# Altium project RF-Test-Board.PrjPcb (part 1 of 2)
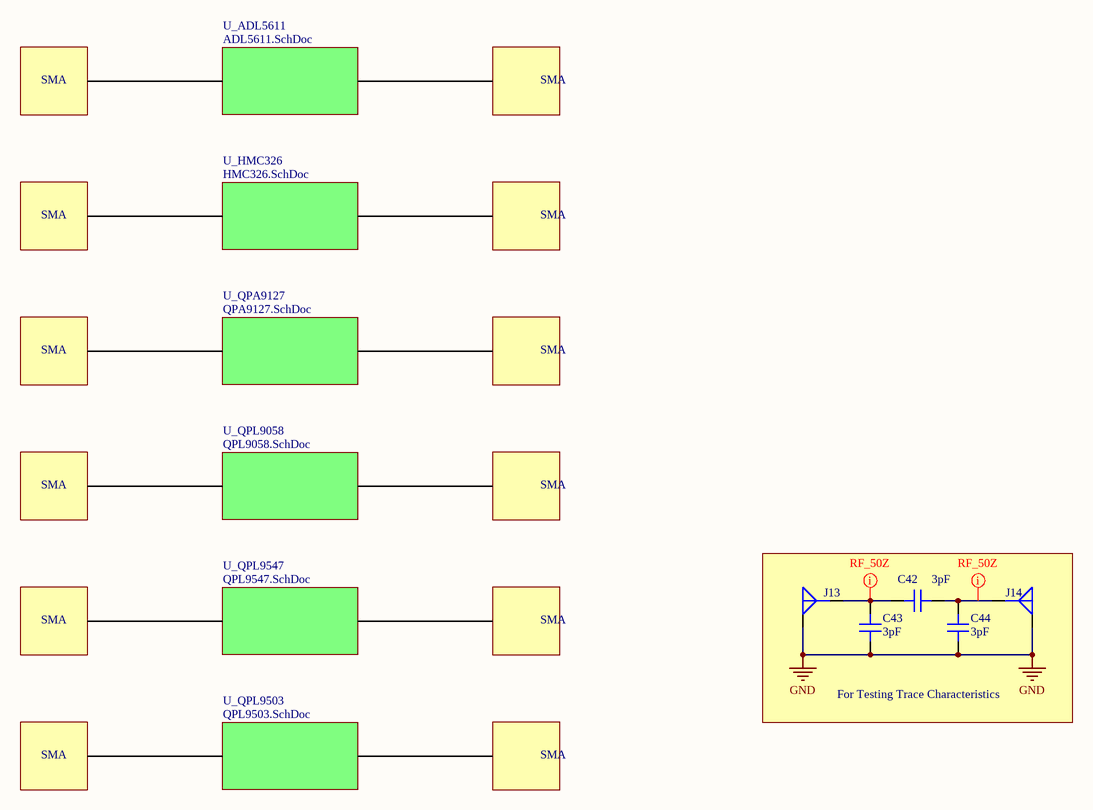
[diagram p0: RF-Test-Board-Sch.SchDoc]
7 sheets, 98 parts. Net scope: global (net labels, ports and power ports of the same name join across sheets).
Board file: RF-Test-Board-Pcb.PcbDoc
Sheets:
  RF-Test-Board-Sch.SchDoc
    U_ADL5611 = ADL5611.SchDoc
    U_HMC326 = HMC326.SchDoc
    U_QPA9127 = QPA9127.SchDoc
    U_QPL9058 = QPL9058.SchDoc
    U_QPL9547 = QPL9547.SchDoc
    U_QPL9503 = QPL9503.SchDoc

## Sheet RF-Test-Board-Sch.SchDoc
size A4; Organization: Altium Limited; Address1: L3, 12a Rodborough Rd; Address2: Frenchs Forest; Address3: NSW; Address4: Australia 2086; DocumentNumber: 1; SheetNumber: 1; SheetTotal: 7

### Parts
C42  3pF  [CAP 0402_1005 RF]
C43  3pF  [CAP 0402_1005 RF]
C44  3pF  [CAP 0402_1005 RF]
J13  CON-SMA-EDGE-S  [CON-SMA-EDGE-S]  (value not drawn)
J14  CON-SMA-EDGE-S  [CON-SMA-EDGE-S]  (value not drawn)

### Blocks framed on the sheet
For Testing Trace Characteristics: C42-C44 J13 J14

### Sub-sheets
U_ADL5611 = ADL5611.SchDoc: no entries
U_HMC326 = HMC326.SchDoc: no entries
U_QPA9127 = QPA9127.SchDoc: no entries
U_QPL9058 = QPL9058.SchDoc: no entries
U_QPL9503 = QPL9503.SchDoc: no entries
U_QPL9547 = QPL9547.SchDoc: no entries

### Nets
GND: C43.1 C44.1 J13.2(G) J14.2(G)
NetC42_1: C42.1 C44.2 J14.1(S)
NetC42_2: C42.2 C43.2 J13.1(S)

### Layout directives
net class RF_50Z: NetC42_1, NetC42_2

### Notes on the sheet
- SMA
- Title
- Author:
- Murat Kucukyilmaz
- Number:
- Date:
- Sheet
- of

### Library data of the parts
C42-C44 = GJM1555C1H3R0CB01J: CAP CER 3PF 50V C0G/NP0 0402; Manufacturer: Murata Electronics; Temperature Coefficient: C0G, NP0; Tolerance: ±0.25pF; Part Number: GJM1555C1H3R0CB01J; Applications: RF, Microwave, High Frequency; Capacitance: 3pF; ComponentLink1Description: Datasheet; ComponentLink1URL: https://search.murata.co.jp/Ceramy/image/img/A01X/G101/ENG/GJM1555C1H3R0CB01-01.pdf; ComponentLink2Description: DigiKey Link; ComponentLink2URL: http://digikey.com/product-detail/en/murata-electronics/GJM1555C1H3R0CB01J/490-8096-1-ND/4380382; Device Package: 0402 (1005 Metric); Features: High Q, Low Loss; LastUpdated: 2.09.2020 01:17:08; Lifecycle Status: Active; Minimum Order: 1; Mounting Type: Surface Mount, MLCC; Operating Temperature: -55°C ~ 125°C; Package / Case: 0402 (1005 Metric); Packaging: TapeAndReel; PartId: 492; Part Status: Active; Price: 0.01; Series: GJM; Size / Dimension: 0.039" L x 0.020" W (1.00mm x 0.50mm); Supplier 1: DigiKey; Supplier Part Number 1: 490-8096-1-ND; Thickness (Max): 0.022" (0.55mm); Value: 3pF; Voltage - Rated: 50V
J13 J14 = CON-SMA-EDGE-S: CONN SMA JACK STR EDGE MNT; Part Number: CON-SMA-EDGE-S; Supplier 1: Digi-Key; Supplier 2: Mouser; Supplier Part Number 1: CON-SMA-EDGE-S-ND; Supplier Part Number 2: 223-CON-SMA-EDGE-S

## Sheet ADL5611.SchDoc
size A4; Organization: Altium Limited; Address1: L3, 12a Rodborough Rd; Address2: Frenchs Forest; Address3: NSW; Address4: Australia 2086; DocumentNumber: 3; SheetNumber: 3; SheetTotal: 7
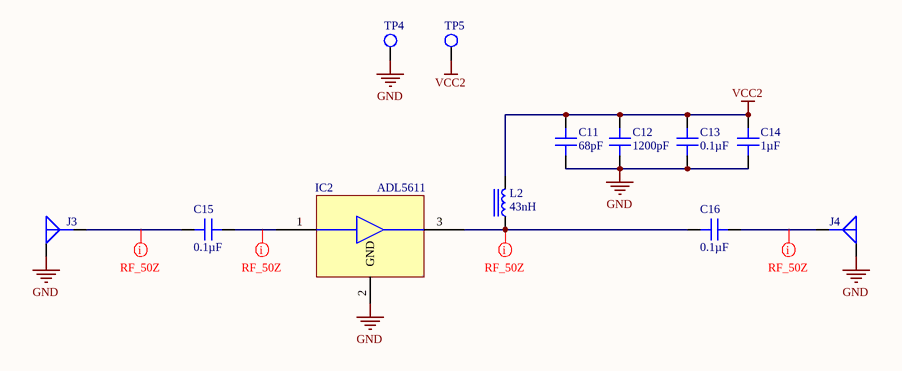
[diagram p1: ADL5611.SchDoc]

### Parts
C11  68pF  [CAP 0402_1005]
C12  1200pF  [CAP 0402_1005]
C13  0.1µF  [CAP 0402_1005]
C14  1µF  [CAP 0402_1005]
C15  0.1µF  [CAP 0402_1005]
C16  0.1µF  [CAP 0402_1005]
IC2  ADL5611  [Analog SOT-89]
J3  CON-SMA-EDGE-S  [CON-SMA-EDGE-S]  (value not drawn)
J4  CON-SMA-EDGE-S  [CON-SMA-EDGE-S]  (value not drawn)
L2  43nH  [0603HP]
TP4  Test Point-THM  [KEYSTONE-THM-TestPoint]  (value not drawn)
TP5  Test Point-THM  [KEYSTONE-THM-TestPoint]  (value not drawn)

### Nets
GND: C11.1 C12.1 C13.1 C14.1 IC2.2(GND) J3.2(G) J4.2(G) TP4.1(TP)
VCC2: C11.2 C12.2 C13.2 C14.2 L2.2 TP5.1(TP)
NetC15_1: C15.1 IC2.1(IN)
NetC15_2: C15.2 J3.1(S)
NetC16_1: C16.1 J4.1(S)
NetC16_2: C16.2 IC2.3(OUT) L2.1

### Layout directives
net class RF_50Z: NetC15_1, NetC15_2, NetC16_1, NetC16_2

### Notes on the sheet
- Title
- Author:
- Murat Kucukyilmaz
- Number:
- Date:
- Sheet
- of

### Library data of the parts
C11 = GCM1555C1H680JA16D: CAP CER 68PF 50V C0G/NP0 0402; Manufacturer: Murata Electronics; Temperature Coefficient: C0G, NP0; Tolerance: ±5%; Part Number: GCM1555C1H680JA16D; Value: 68pF; Applications: Automotive; Capacitance: 68pF; ComponentLink1Description: Datasheet; ComponentLink1URL: https://www.murata.com/~/media/webrenewal/support/library/catalog/products/capacitor/mlcc/c03e.ashx?la=en-us; ComponentLink2Description: DigiKey Link; ComponentLink2URL: http://digikey.com/product-detail/en/murata-electronics/GCM1555C1H680JA16D/490-12653-1-ND/5797622; Device Package: 0402 (1005 Metric); LastUpdated: 2.09.2020 01:02:15; Lifecycle Status: Active; Minimum Order: 1; Mounting Type: Surface Mount, MLCC; Operating Temperature: -55°C ~ 125°C; Package / Case: 0402 (1005 Metric); Packaging: TapeAndReel; PartId: 5827; Part Status: Active; Price: 0.01; Ratings: AEC-Q200; Series: GCM; Size / Dimension: 0.039" L x 0.020" W (1.00mm x 0.50mm); Supplier 1: DigiKey; Supplier Part Number 1: 490-12653-1-ND; Thickness (Max): 0.022" (0.55mm); Voltage - Rated: 50V
C12 = GCM155R71H122JA37D: CAP CER 1200PF 50V X7R 0402; Manufacturer: Murata Electronics; Tolerance: ±5%; Part Number: GCM155R71H122JA37D; Value: 1200pF; Applications: Automotive; Capacitance: 1200pF; ComponentLink1Description: Datasheet; ComponentLink1URL: https://search.murata.co.jp/Ceramy/image/img/A01X/G101/ENG/GCM155R71H122JA37-01.pdf; ComponentLink2Description: DigiKey Link; ComponentLink2URL: http://digikey.com/product-detail/en/murata-electronics/GCM155R71H122JA37D/490-17759-1-ND/8539995; Device Package: 0402 (1005 Metric); LastUpdated: 2.09.2020 01:02:22; Lifecycle Status: Active; Minimum Order: 1; Mounting Type: Surface Mount, MLCC; Operating Temperature: -55°C ~ 125°C; Package / Case: 0402 (1005 Metric); Packaging: TapeAndReel; PartId: 2713; Part Status: Active; Price: 0.01; Ratings: AEC-Q200; Series: GCM; Size / Dimension: 0.039" L x 0.020" W (1.00mm x 0.50mm); Supplier 1: DigiKey; Supplier Part Number 1: 490-17759-1-ND; Temperature Coefficient: X7R; Thickness (Max): 0.022" (0.55mm); Voltage - Rated: 50V
C13 C15 C16 = EMK105B7104KV-F: CAP CER 0.1UF 16V X7R 0402; Manufacturer: Taiyo Yuden; Tolerance: ±10%; Part Number: EMK105B7104KV-F; Value: 0.1µF; Applications: General Purpose; Capacitance: 0.1µF; ComponentLink1Description: Datasheet; ComponentLink1URL: https://ds.yuden.co.jp/TYCOMPAS/ut/detail?pn=EMK105B7104KV-F  &u=M; ComponentLink2Description: DigiKey Link; ComponentLink2URL: http://digikey.com/product-detail/en/taiyo-yuden/EMK105B7104KV-F/587-1451-1-ND/1004082; Device Package: 0402 (1005 Metric); LastUpdated: 2.09.2020 01:02:15; Lifecycle Status: Active; Minimum Order: 1; Mounting Type: Surface Mount, MLCC; Operating Temperature: -55°C ~ 125°C; Package / Case: 0402 (1005 Metric); Packaging: CutTape; PartId: 6070; Part Status: Active; Price: 0.10; Series: M; Size / Dimension: 0.039" L x 0.020" W (1.00mm x 0.50mm); Supplier 1: DigiKey; Supplier Part Number 1: 587-1451-1-ND; Temperature Coefficient: X7R; Thickness (Max): 0.022" (0.55mm); Voltage - Rated: 16V
C14 = CL05A105KP5NNNC: CAP CER 1UF 10V X5R 0402; Manufacturer: Samsung Electro-Mechanics; Tolerance: ±10%; Part Number: CL05A105KP5NNNC; Value: 1µF; Applications: General Purpose; Capacitance: 1µF; ComponentLink1Description: Datasheet; ComponentLink1URL: http://www.samsungsem.com/kr/support/product-search/mlcc/CL05A105KP5NNNC.jsp; ComponentLink2Description: DigiKey Link; ComponentLink2URL: http://digikey.com/product-detail/en/samsung-electro-mechanics/CL05A105KP5NNNC/1276-1076-1-ND/3889162; Device Package: 0402 (1005 Metric); LastUpdated: 2.09.2020 01:02:21; Lifecycle Status: Active; Minimum Order: 1; Mounting Type: Surface Mount, MLCC; Operating Temperature: -55°C ~ 85°C; Package / Case: 0402 (1005 Metric); Packaging: TapeAndReel; PartId: 3103; Part Status: Active; Price: 0.01; Series: CL; Size / Dimension: 0.039" L x 0.020" W (1.00mm x 0.50mm); Supplier 1: DigiKey; Supplier Part Number 1: 1276-1076-1-ND; Temperature Coefficient: X5R; Thickness (Max): 0.022" (0.55mm); Voltage - Rated: 10V
IC2 = ADL5611: IC AMP W-CDMA 30MHZ-6GHZ SOT89-3; Part Number: ADL5611; Supplier 1: Digi-Key; Supplier 2: Mouser; Supplier Part Number 1: ADL5611ARKZ-R7CT-ND; Supplier Part Number 2: 584-ADL5611ARKZ-R7
J3 J4 = CON-SMA-EDGE-S: CONN SMA JACK STR EDGE MNT; Part Number: CON-SMA-EDGE-S; Supplier 1: Digi-Key; Supplier 2: Mouser; Supplier Part Number 1: CON-SMA-EDGE-S-ND; Supplier Part Number 2: 223-CON-SMA-EDGE-S
L2 = 0603HP-43NXGLW: Fixed Inductors 0603 43nH Unshld 2% 810mA 170mOhms; Value: 43nH; Supplier 1: Mouser; Supplier Part Number 1: 994-0603HP-43NXGLW
TP4 TP5 = Test Point-THM: THRU HOLE MOUNT TEST POINTS; Supplier 1: Digi-Key; Supplier 2: Mouser; Supplier Part Number 1: 36-5012-ND; Supplier Part Number 2: 534-5012

## Sheet HMC326.SchDoc
size A4; Organization: Altium Limited; Address1: L3, 12a Rodborough Rd; Address2: Frenchs Forest; Address3: NSW; Address4: Australia 2086; DocumentNumber: 2; SheetNumber: 2; SheetTotal: 7
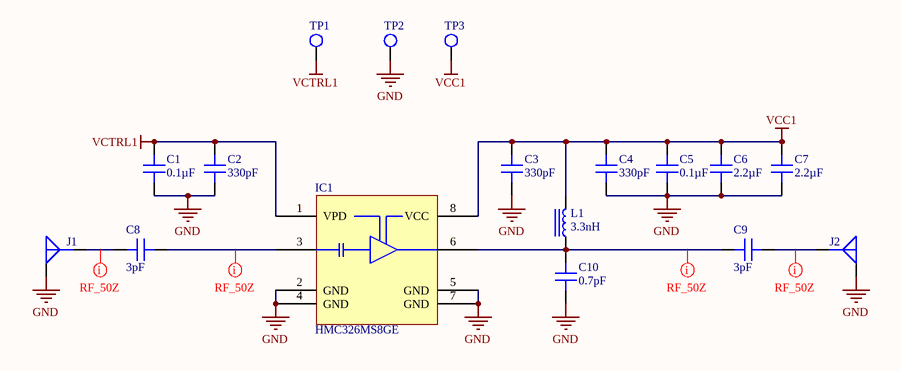
[diagram p2: HMC326.SchDoc]

### Parts
C1  0.1µF  [CAP 0402_1005]
C2  330pF  [CAP 0402_1005]
C3  330pF  [CAP 0402_1005]
C4  330pF  [CAP 0402_1005]
C5  0.1µF  [CAP 0402_1005]
C6  2.2µF  [CAP 0402_1005]
C7  2.2µF  [CAP 0402_1005]
C8  3pF  [CAP 0402_1005 RF]
C9  3pF  [CAP 0402_1005 RF]
C10  0.7pF  [CAP 0402_1005 RF]
IC1  HMC326MS8GE  [ANALOG MSOP8G 3x3MM]
J1  CON-SMA-EDGE-S  [CON-SMA-EDGE-S]  (value not drawn)
J2  CON-SMA-EDGE-S  [CON-SMA-EDGE-S]  (value not drawn)
L1  3.3nH  [0603HP]
TP1  Test Point-THM  [KEYSTONE-THM-TestPoint]  (value not drawn)
TP2  Test Point-THM  [KEYSTONE-THM-TestPoint]  (value not drawn)
TP3  Test Point-THM  [KEYSTONE-THM-TestPoint]  (value not drawn)

### Nets
GND: C1.1 C2.1 C3.1 C4.1 C5.1 C6.1 C7.1 C10.1 IC1.2(GND) IC1.4(GND) IC1.5(GND) IC1.7(GND) J1.2(G) J2.2(G) TP2.1(TP)
VCC1: C3.2 C4.2 C5.2 C6.2 C7.2 IC1.8(VCC) L1.2 TP3.1(TP)
VCTRL1: C1.2 C2.2 IC1.1(VPD) TP1.1(TP)
NetC8_1: C8.1 IC1.3(IN)
NetC8_2: C8.2 J1.1(S)
NetC9_1: C9.1 C10.2 IC1.6(OUT) L1.1
NetC9_2: C9.2 J2.1(S)

### Layout directives
net class RF_50Z: NetC8_1, NetC8_2, NetC9_1, NetC9_2

### Notes on the sheet
- Title
- Author:
- Murat Kucukyilmaz
- Number:
- Date:
- Sheet
- of

### Library data of the parts
C1 C5 = EMK105B7104KV-F: as C13 on sheet ADL5611; Part Number: EMK105B7104KV-F; Value: 0.1µF; Applications: General Purpose; Capacitance: 0.1µF; ComponentLink1Description: Datasheet; ComponentLink1URL: https://ds.yuden.co.jp/TYCOMPAS/ut/detail?pn=EMK105B7104KV-F  &u=M; ComponentLink2Description: DigiKey Link; ComponentLink2URL: http://digikey.com/product-detail/en/taiyo-yuden/EMK105B7104KV-F/587-1451-1-ND/1004082; Device Package: 0402 (1005 Metric); LastUpdated: 2.09.2020 01:02:15; Lifecycle Status: Active; Minimum Order: 1; Mounting Type: Surface Mount, MLCC; Operating Temperature: -55°C ~ 125°C; Package / Case: 0402 (1005 Metric); Packaging: CutTape; PartId: 6070; Part Status: Active; Price: 0.10; Series: M; Size / Dimension: 0.039" L x 0.020" W (1.00mm x 0.50mm); Supplier 1: DigiKey; Supplier Part Number 1: 587-1451-1-ND; Temperature Coefficient: X7R; Thickness (Max): 0.022" (0.55mm); Voltage - Rated: 16V
C2-C4 = CL05B331KB5NNNC: CAP CER 330PF 50V X7R 0402; Manufacturer: Samsung Electro-Mechanics; Tolerance: ±10%; Part Number: CL05B331KB5NNNC; Value: 330pF; Applications: General Purpose; Capacitance: 330pF; ComponentLink1Description: Datasheet; ComponentLink1URL: http://www.samsungsem.com/kr/support/product-search/mlcc/CL05B331KB5NNNC.jsp; ComponentLink2Description: DigiKey Link; ComponentLink2URL: http://digikey.com/product-detail/en/samsung-electro-mechanics/CL05B331KB5NNNC/1276-1546-1-ND/3889632; Device Package: 0402 (1005 Metric); LastUpdated: 2.09.2020 01:02:05; Lifecycle Status: Active; Minimum Order: 1; Mounting Type: Surface Mount, MLCC; Operating Temperature: -55°C ~ 125°C; Package / Case: 0402 (1005 Metric); Packaging: TapeAndReel; PartId: 10570; Part Status: Active; Price: 0.01; Series: CL; Size / Dimension: 0.039" L x 0.020" W (1.00mm x 0.50mm); Supplier 1: DigiKey; Supplier Part Number 1: 1276-1546-1-ND; Temperature Coefficient: X7R; Thickness (Max): 0.022" (0.55mm); Voltage - Rated: 50V
C6 C7 = LMK105BJ225MV-F: CAP CER 2.2UF 10V X5R 0402; Manufacturer: Taiyo Yuden; Tolerance: ±20%; Part Number: LMK105BJ225MV-F; Value: 2.2µF; Applications: General Purpose; Capacitance: 2.2µF; ComponentLink1Description: Datasheet; ComponentLink1URL: https://www.yuden.co.jp/productdata/catalog/mlcc01_e.pdf; ComponentLink2Description: DigiKey Link; ComponentLink2URL: http://digikey.com/product-detail/en/taiyo-yuden/LMK105BJ225MV-F/587-3153-1-ND/2774767; Device Package: 0402 (1005 Metric); LastUpdated: 2.09.2020 01:02:21; Lifecycle Status: Active; Minimum Order: 1; Mounting Type: Surface Mount, MLCC; Operating Temperature: -55°C ~ 85°C; Package / Case: 0402 (1005 Metric); Packaging: TapeAndReel; PartId: 3142; Part Status: Active; Price: 0.01; Series: M; Size / Dimension: 0.039" L x 0.020" W (1.00mm x 0.50mm); Supplier 1: DigiKey; Supplier Part Number 1: 587-3153-1-ND; Temperature Coefficient: X5R; Thickness (Max): 0.022" (0.55mm); Voltage - Rated: 10V
C8 C9 = GJM1555C1H3R0CB01J: as C42 on sheet RF-Test-Board-Sch; Part Number: GJM1555C1H3R0CB01J; Applications: RF, Microwave, High Frequency; Capacitance: 3pF; ComponentLink1Description: Datasheet; ComponentLink1URL: https://search.murata.co.jp/Ceramy/image/img/A01X/G101/ENG/GJM1555C1H3R0CB01-01.pdf; ComponentLink2Description: DigiKey Link; ComponentLink2URL: http://digikey.com/product-detail/en/murata-electronics/GJM1555C1H3R0CB01J/490-8096-1-ND/4380382; Device Package: 0402 (1005 Metric); Features: High Q, Low Loss; LastUpdated: 2.09.2020 01:17:08; Lifecycle Status: Active; Minimum Order: 1; Mounting Type: Surface Mount, MLCC; Operating Temperature: -55°C ~ 125°C; Package / Case: 0402 (1005 Metric); Packaging: TapeAndReel; PartId: 492; Part Status: Active; Price: 0.01; Series: GJM; Size / Dimension: 0.039" L x 0.020" W (1.00mm x 0.50mm); Supplier 1: DigiKey; Supplier Part Number 1: 490-8096-1-ND; Thickness (Max): 0.022" (0.55mm); Value: 3pF; Voltage - Rated: 50V
C10 = GJM1555C1HR70BB01D: CAP CER 0.7PF 50V C0G/NP0 0402; Manufacturer: Murata Electronics; Temperature Coefficient: C0G, NP0; Tolerance: ±0.1pF; Part Number: GJM1555C1HR70BB01D; Applications: RF, Microwave, High Frequency; Capacitance: 0.7pF; ComponentLink1Description: Datasheet; ComponentLink1URL: https://search.murata.co.jp/Ceramy/image/img/A01X/G101/ENG/GJM1555C1HR70BB01-01.pdf; ComponentLink2Description: DigiKey Link; ComponentLink2URL: http://digikey.com/product-detail/en/murata-electronics/GJM1555C1HR70BB01D/490-6079-1-ND/3845279; Device Package: 0402 (1005 Metric); Features: High Q, Low Loss; LastUpdated: 2.09.2020 01:17:05; Lifecycle Status: Active; Minimum Order: 1; Mounting Type: Surface Mount, MLCC; Operating Temperature: -55°C ~ 125°C; Package / Case: 0402 (1005 Metric); Packaging: TapeAndReel; PartId: 1691; Part Status: Active; Price: 0.03; Series: GJM; Size / Dimension: 0.039" L x 0.020" W (1.00mm x 0.50mm); Supplier 1: DigiKey; Supplier Part Number 1: 490-6079-1-ND; Thickness (Max): 0.022" (0.55mm); Value: 0.7pF; Voltage - Rated: 50V
IC1 = HMC326MS8GE: IC RF AMP GP 3GHZ-4.5GHZ 8MSOP; Part Number: HMC326MS8GE; Supplier 1: Digi-Key; Supplier Part Number 1: 1127-1333-ND
J1 J2 = CON-SMA-EDGE-S: CONN SMA JACK STR EDGE MNT; Part Number: CON-SMA-EDGE-S; Supplier 1: Digi-Key; Supplier 2: Mouser; Supplier Part Number 1: CON-SMA-EDGE-S-ND; Supplier Part Number 2: 223-CON-SMA-EDGE-S
L1 = 0603HP-3N3XGLW: Fixed Inductors 0603 3.3nH Unshld 2% 1.9A 24mOhms; Value: 3.3nH; Supplier 1: Mouser; Supplier Part Number 1: 994-0603HP-3N3XGLW
TP1-TP3 = Test Point-THM: THRU HOLE MOUNT TEST POINTS; Supplier 1: Digi-Key; Supplier 2: Mouser; Supplier Part Number 1: 36-5012-ND; Supplier Part Number 2: 534-5012

## Sheet QPA9127.SchDoc
size A4; Organization: Altium Limited; Address1: L3, 12a Rodborough Rd; Address2: Frenchs Forest; Address3: NSW; Address4: Australia 2086; DocumentNumber: 4; SheetNumber: 4; SheetTotal: 7
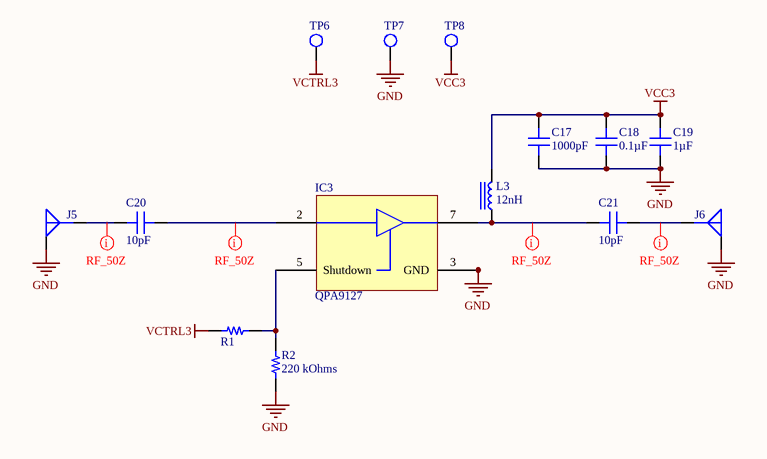
[diagram p3: QPA9127.SchDoc]

### Parts
C17  1000pF  [CAP 0402_1005]
C18  0.1µF  [CAP 0402_1005]
C19  1µF  [CAP 0402_1005]
C20  10pF  [CAP 0402_1005 RF]
C21  10pF  [CAP 0402_1005 RF]
IC3  QPA9127  [Qorvo PA DFN-8 2X2]
J5  CON-SMA-EDGE-S  [CON-SMA-EDGE-S]  (value not drawn)
J6  CON-SMA-EDGE-S  [CON-SMA-EDGE-S]  (value not drawn)
L3  12nH  [0603HP]
R1  (no value)  [RES 0402_1005]
R2  220 kOhms  [RES 0402_1005]
TP6  Test Point-THM  [KEYSTONE-THM-TestPoint]  (value not drawn)
TP7  Test Point-THM  [KEYSTONE-THM-TestPoint]  (value not drawn)
TP8  Test Point-THM  [KEYSTONE-THM-TestPoint]  (value not drawn)

### Nets
GND: C17.1 C18.1 C19.1 IC3.1(GND) IC3.3(GND) IC3.4(GND) IC3.6(GND) IC3.8(GND) IC3.9(GND) J5.2(G) J6.2(G) R2.1 TP7.1(TP)
VCC3: C17.2 C18.2 C19.2 L3.2 TP8.1(TP)
VCTRL3: R1.1 TP6.1(TP)
NetC20_1: C20.1 J5.1(S)
NetC20_2: C20.2 IC3.2(IN)
NetC21_1: C21.1 IC3.7(OUT) L3.1
NetC21_2: C21.2 J6.1(S)
NetIC3_5: IC3.5(Shutdown) R1.2 R2.2

### Layout directives
net class RF_50Z: NetC20_1, NetC20_2, NetC21_1, NetC21_2

### Notes on the sheet
- Title
- Author:
- Murat Kucukyilmaz
- Number:
- Date:
- Sheet
- of

### Library data of the parts
C17 = GCM155R71H102KA37D: CAP CER 1000PF 50V X7R 0402; Manufacturer: Murata Electronics; Tolerance: ±10%; Part Number: GCM155R71H102KA37D; Value: 1000pF; Applications: Automotive; Capacitance: 1000pF; ComponentLink1Description: Datasheet; ComponentLink1URL: https://psearch.en.murata.com/capacitor/product/GCM155R71H102KA37%23.pdf; ComponentLink2Description: DigiKey Link; ComponentLink2URL: http://digikey.com/product-detail/en/murata-electronics/GCM155R71H102KA37D/490-4761-1-ND/1641680; Device Package: 0402 (1005 Metric); LastUpdated: 2.09.2020 01:01:39; Lifecycle Status: Active; Minimum Order: 1; Mounting Type: Surface Mount, MLCC; Operating Temperature: -55°C ~ 125°C; Package / Case: 0402 (1005 Metric); Packaging: TapeAndReel; PartId: 12579; Part Status: Active; Price: 0.01; Ratings: AEC-Q200; Series: GCM; Size / Dimension: 0.039" L x 0.020" W (1.00mm x 0.50mm); Supplier 1: DigiKey; Supplier Part Number 1: 490-4761-1-ND; Temperature Coefficient: X7R; Thickness (Max): 0.022" (0.55mm); Voltage - Rated: 50V
C18 = EMK105B7104KV-F: as C13 on sheet ADL5611; Part Number: EMK105B7104KV-F; Value: 0.1µF; Applications: General Purpose; Capacitance: 0.1µF; ComponentLink1Description: Datasheet; ComponentLink1URL: https://ds.yuden.co.jp/TYCOMPAS/ut/detail?pn=EMK105B7104KV-F  &u=M; ComponentLink2Description: DigiKey Link; ComponentLink2URL: http://digikey.com/product-detail/en/taiyo-yuden/EMK105B7104KV-F/587-1451-1-ND/1004082; Device Package: 0402 (1005 Metric); LastUpdated: 2.09.2020 01:02:15; Lifecycle Status: Active; Minimum Order: 1; Mounting Type: Surface Mount, MLCC; Operating Temperature: -55°C ~ 125°C; Package / Case: 0402 (1005 Metric); Packaging: CutTape; PartId: 6070; Part Status: Active; Price: 0.10; Series: M; Size / Dimension: 0.039" L x 0.020" W (1.00mm x 0.50mm); Supplier 1: DigiKey; Supplier Part Number 1: 587-1451-1-ND; Temperature Coefficient: X7R; Thickness (Max): 0.022" (0.55mm); Voltage - Rated: 16V
C19 = CL05A105KP5NNNC: as C14 on sheet ADL5611; Part Number: CL05A105KP5NNNC; Value: 1µF; Applications: General Purpose; Capacitance: 1µF; ComponentLink1Description: Datasheet; ComponentLink1URL: http://www.samsungsem.com/kr/support/product-search/mlcc/CL05A105KP5NNNC.jsp; ComponentLink2Description: DigiKey Link; ComponentLink2URL: http://digikey.com/product-detail/en/samsung-electro-mechanics/CL05A105KP5NNNC/1276-1076-1-ND/3889162; Device Package: 0402 (1005 Metric); LastUpdated: 2.09.2020 01:02:21; Lifecycle Status: Active; Minimum Order: 1; Mounting Type: Surface Mount, MLCC; Operating Temperature: -55°C ~ 85°C; Package / Case: 0402 (1005 Metric); Packaging: TapeAndReel; PartId: 3103; Part Status: Active; Price: 0.01; Series: CL; Size / Dimension: 0.039" L x 0.020" W (1.00mm x 0.50mm); Supplier 1: DigiKey; Supplier Part Number 1: 1276-1076-1-ND; Temperature Coefficient: X5R; Thickness (Max): 0.022" (0.55mm); Voltage - Rated: 10V
C20 C21 = GJM1555C1H100FB01D: CAP CER 10PF 50V C0G/NP0 0402; Manufacturer: Murata Electronics; Temperature Coefficient: C0G, NP0; Tolerance: ±1%; Part Number: GJM1555C1H100FB01D; Applications: RF, Microwave, High Frequency; Capacitance: 10pF; ComponentLink1Description: Datasheet; ComponentLink1URL: https://search.murata.co.jp/Ceramy/image/img/A01X/G101/ENG/GJM1555C1H100FB01-01.pdf; ComponentLink2Description: DigiKey Link; ComponentLink2URL: http://digikey.com/product-detail/en/murata-electronics/GJM1555C1H100FB01D/490-11189-1-ND/5333029; Device Package: 0402 (1005 Metric); Features: High Q, Low Loss; LastUpdated: 2.09.2020 01:17:07; Lifecycle Status: Active; Minimum Order: 1; Mounting Type: Surface Mount, MLCC; Operating Temperature: -55°C ~ 125°C; Package / Case: 0402 (1005 Metric); Packaging: TapeAndReel; PartId: 560; Part Status: Active; Price: 0.04; Series: GJM; Size / Dimension: 0.039" L x 0.020" W (1.00mm x 0.50mm); Supplier 1: DigiKey; Supplier Part Number 1: 490-11189-1-ND; Thickness (Max): 0.022" (0.55mm); Value: 10pF; Voltage - Rated: 50V
IC3 = QPA9127: High Linearity Gain Block; Part Number: QPA9127; Supplier 1: Mouser; Supplier Part Number 1: 772-QPA9127TR7
J5 J6 = CON-SMA-EDGE-S: CONN SMA JACK STR EDGE MNT; Part Number: CON-SMA-EDGE-S; Supplier 1: Digi-Key; Supplier 2: Mouser; Supplier Part Number 1: CON-SMA-EDGE-S-ND; Supplier Part Number 2: 223-CON-SMA-EDGE-S
L3 = 0603HP-12NXGLW: Fixed Inductors 0603 12nH Unshld 2% 1.1A 88mOhms; Value: 12nH; Supplier 1: Mouser; Supplier Part Number 1: 994-0603HP-12NXGLW
R1 = RC0402JR-070RP: RES SMD 0 OHM JUMPER 1/16W 0402; Manufacturer: Yageo; Power (Watts): 0.063W, 1/16W; Part Number: RC0402JR-070RP; ComponentLink1Description: Datasheet; ComponentLink1URL: http://www.yageo.com/NewPortal/yageodocoutput?fileName=/pdf/R-Chip/PYu-RC_51_RoHS_P_0.pdf; ComponentLink2Description: DigiKey Link; ComponentLink2URL: http://digikey.com/product-detail/en/yageo/RC0402JR-070RP/YAG1279CT-ND/4935394; Composition: Thick Film; Device Package: 0402 (1005 Metric); Features: Moisture Resistant; Height - Seated (Max): 0.016" (0.40mm); LastUpdated: 2.09.2020 01:07:33; Lifecycle Status: Active; Minimum Order: 1; Number of Terminations: 2; Operating Temperature: -55°C ~ 155°C; Package / Case: 0402 (1005 Metric); Packaging: CutTape; PartId: 18920; Part Status: Active; Price: 0.10; Series: RC-P Lead Free; Size / Dimension: 0.039" L x 0.020" W (1.00mm x 0.50mm); Supplier 1: DigiKey; Supplier Part Number 1: YAG1279CT-ND; Supplier Device Package: 0402; Tolerance: Jumper
R2 = RC0402FR-07220KL: RES SMD 220K OHM 1% 1/16W 0402; Manufacturer: Yageo; Power (Watts): 0.063W, 1/16W; Temperature Coefficient: ±100ppm/°C; Part Number: RC0402FR-07220KL; Value: 220 kOhms; ComponentLink1Description: Datasheet; ComponentLink1URL: https://www.yageo.com/upload/media/product/productsearch/datasheet/rchip/PYu-RC_Group_51_RoHS_L_10.pdf; ComponentLink2Description: DigiKey Link; ComponentLink2URL: http://digikey.com/product-detail/en/yageo/RC0402FR-07220KL/311-220KLRCT-ND/729511; Composition: Thick Film; Device Package: 0402 (1005 Metric); Features: Moisture Resistant; Height - Seated (Max): 0.016" (0.40mm); LastUpdated: 2.09.2020 01:08:10; Lifecycle Status: Active; Minimum Order: 1; Number of Terminations: 2; Operating Temperature: -55°C ~ 155°C; Package / Case: 0402 (1005 Metric); Packaging: CutTape; PartId: 2589; Part Status: Active; Price: 0.10; Resistance: 220 kOhms; Series: RC; Size / Dimension: 0.039" L x 0.020" W (1.00mm x 0.50mm); Supplier 1: DigiKey; Supplier Part Number 1: 311-220KLRCT-ND; Supplier Device Package: 0402; Tolerance: ±1%
TP6-TP8 = Test Point-THM: THRU HOLE MOUNT TEST POINTS; Supplier 1: Digi-Key; Supplier 2: Mouser; Supplier Part Number 1: 36-5012-ND; Supplier Part Number 2: 534-5012

## Sheet QPL9058.SchDoc
size A4; Organization: Altium Limited; Address1: L3, 12a Rodborough Rd; Address2: Frenchs Forest; Address3: NSW; Address4: Australia 2086; DocumentNumber: 5; SheetNumber: 5; SheetTotal: 7
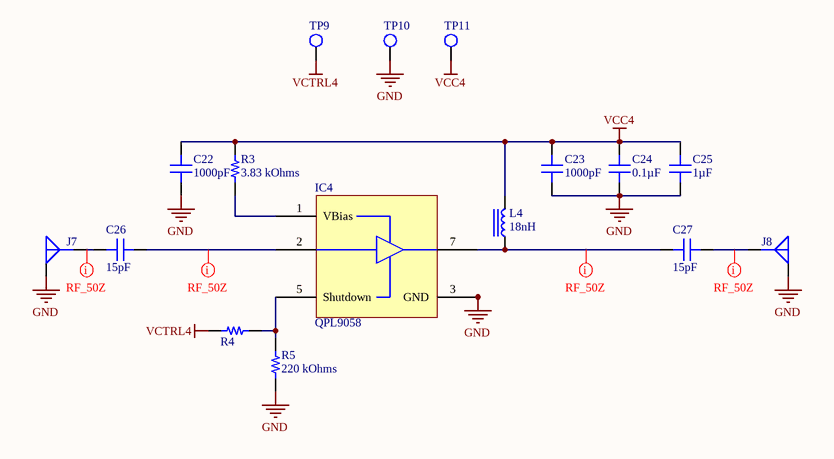
[diagram p4: QPL9058.SchDoc]

### Parts
C22  1000pF  [CAP 0402_1005]
C23  1000pF  [CAP 0402_1005]
C24  0.1µF  [CAP 0402_1005]
C25  1µF  [CAP 0402_1005]
C26  15pF  [CAP 0402_1005 RF]
C27  15pF  [CAP 0402_1005 RF]
IC4  QPL9058  [Qorvo LNA DFN-8 2X2]
J7  CON-SMA-EDGE-S  [CON-SMA-EDGE-S]  (value not drawn)
J8  CON-SMA-EDGE-S  [CON-SMA-EDGE-S]  (value not drawn)
L4  18nH  [0603CS]
R3  3.83 kOhms  [RES 0402_1005]
R4  (no value)  [RES 0402_1005]
R5  220 kOhms  [RES 0402_1005]
TP9  Test Point-THM  [KEYSTONE-THM-TestPoint]  (value not drawn)
TP10  Test Point-THM  [KEYSTONE-THM-TestPoint]  (value not drawn)
TP11  Test Point-THM  [KEYSTONE-THM-TestPoint]  (value not drawn)

### Nets
GND: C22.2 C23.1 C24.1 C25.1 IC4.3(GND) IC4.4(GND) IC4.6(GND) IC4.8(GND) IC4.9(GND) J7.2(G) J8.2(G) R5.1 TP10.1(TP)
VCC4: C22.1 C23.2 C24.2 C25.2 L4.2 R3.2 TP11.1(TP)
VCTRL4: R4.1 TP9.1(TP)
NetC26_1: C26.1 J7.1(S)
NetC26_2: C26.2 IC4.2(IN)
NetC27_1: C27.1 IC4.7(OUT) L4.1
NetC27_2: C27.2 J8.1(S)
NetIC4_1: IC4.1(VBias) R3.1
NetIC4_5: IC4.5(Shutdown) R4.2 R5.2

### Layout directives
net class RF_50Z: NetC26_1, NetC26_2, NetC27_1, NetC27_2

### Notes on the sheet
- Title
- Author:
- Murat Kucukyilmaz
- Number:
- Date:
- Sheet
- of

### Library data of the parts
C22 C23 = GCM155R71H102KA37D: as C17 on sheet QPA9127; Part Number: GCM155R71H102KA37D; Value: 1000pF; Applications: Automotive; Capacitance: 1000pF; ComponentLink1Description: Datasheet; ComponentLink1URL: https://psearch.en.murata.com/capacitor/product/GCM155R71H102KA37%23.pdf; ComponentLink2Description: DigiKey Link; ComponentLink2URL: http://digikey.com/product-detail/en/murata-electronics/GCM155R71H102KA37D/490-4761-1-ND/1641680; Device Package: 0402 (1005 Metric); LastUpdated: 2.09.2020 01:01:39; Lifecycle Status: Active; Minimum Order: 1; Mounting Type: Surface Mount, MLCC; Operating Temperature: -55°C ~ 125°C; Package / Case: 0402 (1005 Metric); Packaging: TapeAndReel; PartId: 12579; Part Status: Active; Price: 0.01; Ratings: AEC-Q200; Series: GCM; Size / Dimension: 0.039" L x 0.020" W (1.00mm x 0.50mm); Supplier 1: DigiKey; Supplier Part Number 1: 490-4761-1-ND; Temperature Coefficient: X7R; Thickness (Max): 0.022" (0.55mm); Voltage - Rated: 50V
C24 = EMK105B7104KV-F: as C13 on sheet ADL5611; Part Number: EMK105B7104KV-F; Value: 0.1µF; Applications: General Purpose; Capacitance: 0.1µF; ComponentLink1Description: Datasheet; ComponentLink1URL: https://ds.yuden.co.jp/TYCOMPAS/ut/detail?pn=EMK105B7104KV-F  &u=M; ComponentLink2Description: DigiKey Link; ComponentLink2URL: http://digikey.com/product-detail/en/taiyo-yuden/EMK105B7104KV-F/587-1451-1-ND/1004082; Device Package: 0402 (1005 Metric); LastUpdated: 2.09.2020 01:02:15; Lifecycle Status: Active; Minimum Order: 1; Mounting Type: Surface Mount, MLCC; Operating Temperature: -55°C ~ 125°C; Package / Case: 0402 (1005 Metric); Packaging: CutTape; PartId: 6070; Part Status: Active; Price: 0.10; Series: M; Size / Dimension: 0.039" L x 0.020" W (1.00mm x 0.50mm); Supplier 1: DigiKey; Supplier Part Number 1: 587-1451-1-ND; Temperature Coefficient: X7R; Thickness (Max): 0.022" (0.55mm); Voltage - Rated: 16V
C25 = CL05A105KP5NNNC: as C14 on sheet ADL5611; Part Number: CL05A105KP5NNNC; Value: 1µF; Applications: General Purpose; Capacitance: 1µF; ComponentLink1Description: Datasheet; ComponentLink1URL: http://www.samsungsem.com/kr/support/product-search/mlcc/CL05A105KP5NNNC.jsp; ComponentLink2Description: DigiKey Link; ComponentLink2URL: http://digikey.com/product-detail/en/samsung-electro-mechanics/CL05A105KP5NNNC/1276-1076-1-ND/3889162; Device Package: 0402 (1005 Metric); LastUpdated: 2.09.2020 01:02:21; Lifecycle Status: Active; Minimum Order: 1; Mounting Type: Surface Mount, MLCC; Operating Temperature: -55°C ~ 85°C; Package / Case: 0402 (1005 Metric); Packaging: TapeAndReel; PartId: 3103; Part Status: Active; Price: 0.01; Series: CL; Size / Dimension: 0.039" L x 0.020" W (1.00mm x 0.50mm); Supplier 1: DigiKey; Supplier Part Number 1: 1276-1076-1-ND; Temperature Coefficient: X5R; Thickness (Max): 0.022" (0.55mm); Voltage - Rated: 10V
C26 C27 = GJM1555C1H150JB01D: CAP CER 15PF 50V C0G/NP0 0402; Manufacturer: Murata Electronics; Temperature Coefficient: C0G, NP0; Tolerance: ±5%; Part Number: GJM1555C1H150JB01D; Applications: RF, Microwave, High Frequency; Capacitance: 15pF; ComponentLink1Description: Datasheet; ComponentLink1URL: https://search.murata.co.jp/Ceramy/image/img/A01X/G101/ENG/GJM1555C1H150JB01-01.pdf; ComponentLink2Description: DigiKey Link; ComponentLink2URL: http://digikey.com/product-detail/en/murata-electronics/GJM1555C1H150JB01D/490-3117-1-ND/702383; Device Package: 0402 (1005 Metric); Features: High Q, Low Loss; LastUpdated: 2.09.2020 01:17:07; Lifecycle Status: Active; Minimum Order: 1; Mounting Type: Surface Mount, MLCC; Operating Temperature: -55°C ~ 125°C; Package / Case: 0402 (1005 Metric); Packaging: TapeAndReel; PartId: 692; Part Status: Active; Price: 0.04; Series: GJM; Size / Dimension: 0.039" L x 0.020" W (1.00mm x 0.50mm); Supplier 1: DigiKey; Supplier Part Number 1: 490-3117-1-ND; Thickness (Max): 0.022" (0.55mm); Value: 15pF; Voltage - Rated: 50V
IC4 = QPL9058: 0.5 – 6.0 GHz Ultra Low-Noise LNA; Part Number: QPL9058; Supplier 1: RFMW; Supplier Part Number 1: QPL9058
J7 J8 = CON-SMA-EDGE-S: CONN SMA JACK STR EDGE MNT; Part Number: CON-SMA-EDGE-S; Supplier 1: Digi-Key; Supplier 2: Mouser; Supplier Part Number 1: CON-SMA-EDGE-S-ND; Supplier Part Number 2: 223-CON-SMA-EDGE-S
L4 = 0603CS-18NXJLW: Fixed Inductors 1608 18nH Unshld 5% 700mA 170mOhms AECQ2; Value: 18nH; Supplier 1: Mouser; Supplier Part Number 1: 994-0603CS-18NXJLW
R3 = RC0402FR-073K83L: RES SMD 3.83K OHM 1% 1/16W 0402; Manufacturer: Yageo; Power (Watts): 0.063W, 1/16W; Temperature Coefficient: ±100ppm/°C; Part Number: RC0402FR-073K83L; Value: 3.83 kOhms; ComponentLink1Description: Datasheet; ComponentLink1URL: https://www.yageo.com/upload/media/product/productsearch/datasheet/rchip/PYu-RC_Group_51_RoHS_L_10.pdf; ComponentLink2Description: DigiKey Link; ComponentLink2URL: http://digikey.com/product-detail/en/yageo/RC0402FR-073K83L/311-3.83KLRCT-ND/2827952; Composition: Thick Film; Device Package: 0402 (1005 Metric); Features: Moisture Resistant; Height - Seated (Max): 0.016" (0.40mm); LastUpdated: 2.09.2020 01:07:27; Lifecycle Status: Active; Minimum Order: 1; Number of Terminations: 2; Operating Temperature: -55°C ~ 155°C; Package / Case: 0402 (1005 Metric); Packaging: CutTape; PartId: 20859; Part Status: Active; Price: 0.10; Resistance: 3.83 kOhms; Series: RC; Size / Dimension: 0.039" L x 0.020" W (1.00mm x 0.50mm); Supplier 1: DigiKey; Supplier Part Number 1: 311-3.83KLRCT-ND; Supplier Device Package: 0402; Tolerance: ±1%
R4 = RC0402JR-070RP: as R1 on sheet QPA9127; Part Number: RC0402JR-070RP; ComponentLink1Description: Datasheet; ComponentLink1URL: http://www.yageo.com/NewPortal/yageodocoutput?fileName=/pdf/R-Chip/PYu-RC_51_RoHS_P_0.pdf; ComponentLink2Description: DigiKey Link; ComponentLink2URL: http://digikey.com/product-detail/en/yageo/RC0402JR-070RP/YAG1279CT-ND/4935394; Composition: Thick Film; Device Package: 0402 (1005 Metric); Features: Moisture Resistant; Height - Seated (Max): 0.016" (0.40mm); LastUpdated: 2.09.2020 01:07:33; Lifecycle Status: Active; Minimum Order: 1; Number of Terminations: 2; Operating Temperature: -55°C ~ 155°C; Package / Case: 0402 (1005 Metric); Packaging: CutTape; PartId: 18920; Part Status: Active; Price: 0.10; Series: RC-P Lead Free; Size / Dimension: 0.039" L x 0.020" W (1.00mm x 0.50mm); Supplier 1: DigiKey; Supplier Part Number 1: YAG1279CT-ND; Supplier Device Package: 0402; Tolerance: Jumper
R5 = RC0402FR-07220KL: as R2 on sheet QPA9127; Part Number: RC0402FR-07220KL; Value: 220 kOhms; ComponentLink1Description: Datasheet; ComponentLink1URL: https://www.yageo.com/upload/media/product/productsearch/datasheet/rchip/PYu-RC_Group_51_RoHS_L_10.pdf; ComponentLink2Description: DigiKey Link; ComponentLink2URL: http://digikey.com/product-detail/en/yageo/RC0402FR-07220KL/311-220KLRCT-ND/729511; Composition: Thick Film; Device Package: 0402 (1005 Metric); Features: Moisture Resistant; Height - Seated (Max): 0.016" (0.40mm); LastUpdated: 2.09.2020 01:08:10; Lifecycle Status: Active; Minimum Order: 1; Number of Terminations: 2; Operating Temperature: -55°C ~ 155°C; Package / Case: 0402 (1005 Metric); Packaging: CutTape; PartId: 2589; Part Status: Active; Price: 0.10; Resistance: 220 kOhms; Series: RC; Size / Dimension: 0.039" L x 0.020" W (1.00mm x 0.50mm); Supplier 1: DigiKey; Supplier Part Number 1: 311-220KLRCT-ND; Supplier Device Package: 0402; Tolerance: ±1%
TP9-TP11 = Test Point-THM: THRU HOLE MOUNT TEST POINTS; Supplier 1: Digi-Key; Supplier 2: Mouser; Supplier Part Number 1: 36-5012-ND; Supplier Part Number 2: 534-5012

## Sheet QPL9547.SchDoc
size A4; Organization: Altium Limited; Address1: L3, 12a Rodborough Rd; Address2: Frenchs Forest; Address3: NSW; Address4: Australia 2086; DocumentNumber: 6; SheetNumber: 6; SheetTotal: 7
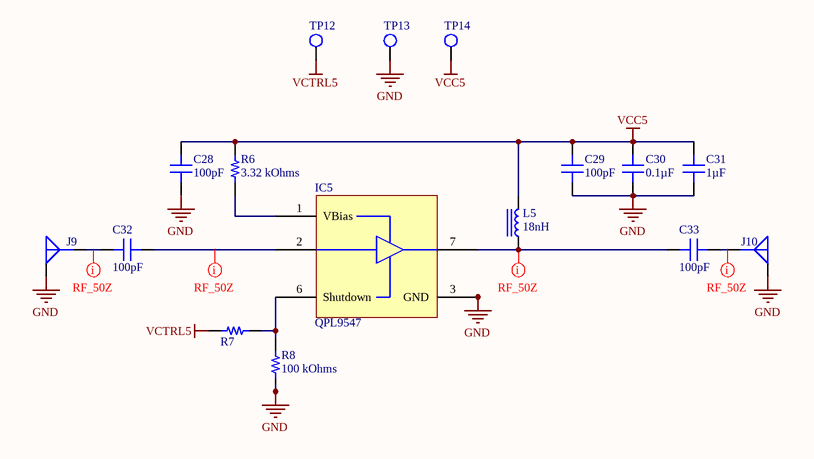
[diagram p5: QPL9547.SchDoc]

### Parts
C28  100pF  [CAP 0402_1005]
C29  100pF  [CAP 0402_1005]
C30  0.1µF  [CAP 0402_1005]
C31  1µF  [CAP 0402_1005]
C32  100pF  [CAP 0402_1005]
C33  100pF  [CAP 0402_1005]
IC5  QPL9547  [Qorvo LNA DFN-8 2X2]
J9  CON-SMA-EDGE-S  [CON-SMA-EDGE-S]  (value not drawn)
J10  CON-SMA-EDGE-S  [CON-SMA-EDGE-S]  (value not drawn)
L5  18nH  [0402CS]
R6  3.32 kOhms  [RES 0402_1005]
R7  (no value)  [RES 0402_1005]
R8  100 kOhms  [RES 0402_1005]
TP12  Test Point-THM  [KEYSTONE-THM-TestPoint]  (value not drawn)
TP13  Test Point-THM  [KEYSTONE-THM-TestPoint]  (value not drawn)
TP14  Test Point-THM  [KEYSTONE-THM-TestPoint]  (value not drawn)

### Nets
GND: C28.1 C29.1 C30.1 C31.1 IC5.3(GND) IC5.4(GND) IC5.5(GND) IC5.8(GND) IC5.9(GND) J9.2(G) J10.2(G) R8.1 TP13.1(TP)
VCC5: C28.2 C29.2 C30.2 C31.2 L5.2 R6.2 TP14.1(TP)
VCTRL5: R7.1 TP12.1(TP)
NetC32_1: C32.1 J9.1(S)
NetC32_2: C32.2 IC5.2(IN)
NetC33_1: C33.1 IC5.7(OUT) L5.1
NetC33_2: C33.2 J10.1(S)
NetIC5_1: IC5.1(VBias) R6.1
NetIC5_6: IC5.6(Shutdown) R7.2 R8.2

### Layout directives
net class RF_50Z: NetC32_1, NetC32_2, NetC33_1, NetC33_2

### Notes on the sheet
- Title
- Author:
- Murat Kucukyilmaz
- Number:
- Date:
- Sheet
- of

### Library data of the parts
C28 C29 C32 C33 = GCM1555C1H101FA16D: CAP CER 100PF 50V C0G/NP0 0402; Manufacturer: Murata Electronics; Temperature Coefficient: C0G, NP0; Tolerance: ±1%; Part Number: GCM1555C1H101FA16D; Value: 100pF; Applications: Automotive; Capacitance: 100pF; ComponentLink1Description: Datasheet; ComponentLink1URL: https://search.murata.co.jp/Ceramy/image/img/A01X/G101/ENG/GCM1555C1H101FA16-01.pdf; ComponentLink2Description: DigiKey Link; ComponentLink2URL: http://digikey.com/product-detail/en/murata-electronics/GCM1555C1H101FA16D/490-14349-1-ND/6606810; Device Package: 0402 (1005 Metric); LastUpdated: 2.09.2020 01:02:12; Lifecycle Status: Active; Minimum Order: 1; Mounting Type: Surface Mount, MLCC; Operating Temperature: -55°C ~ 125°C; Package / Case: 0402 (1005 Metric); Packaging: TapeAndReel; PartId: 7484; Part Status: Active; Price: 0.02; Ratings: AEC-Q200; Series: GCM; Size / Dimension: 0.039" L x 0.020" W (1.00mm x 0.50mm); Supplier 1: DigiKey; Supplier Part Number 1: 490-14349-1-ND; Thickness (Max): 0.022" (0.55mm); Voltage - Rated: 50V
C30 = EMK105B7104KV-F: as C13 on sheet ADL5611; Part Number: EMK105B7104KV-F; Value: 0.1µF; Applications: General Purpose; Capacitance: 0.1µF; ComponentLink1Description: Datasheet; ComponentLink1URL: https://ds.yuden.co.jp/TYCOMPAS/ut/detail?pn=EMK105B7104KV-F  &u=M; ComponentLink2Description: DigiKey Link; ComponentLink2URL: http://digikey.com/product-detail/en/taiyo-yuden/EMK105B7104KV-F/587-1451-1-ND/1004082; Device Package: 0402 (1005 Metric); LastUpdated: 2.09.2020 01:02:15; Lifecycle Status: Active; Minimum Order: 1; Mounting Type: Surface Mount, MLCC; Operating Temperature: -55°C ~ 125°C; Package / Case: 0402 (1005 Metric); Packaging: CutTape; PartId: 6070; Part Status: Active; Price: 0.10; Series: M; Size / Dimension: 0.039" L x 0.020" W (1.00mm x 0.50mm); Supplier 1: DigiKey; Supplier Part Number 1: 587-1451-1-ND; Temperature Coefficient: X7R; Thickness (Max): 0.022" (0.55mm); Voltage - Rated: 16V
C31 = CL05A105KP5NNNC: as C14 on sheet ADL5611; Part Number: CL05A105KP5NNNC; Value: 1µF; Applications: General Purpose; Capacitance: 1µF; ComponentLink1Description: Datasheet; ComponentLink1URL: http://www.samsungsem.com/kr/support/product-search/mlcc/CL05A105KP5NNNC.jsp; ComponentLink2Description: DigiKey Link; ComponentLink2URL: http://digikey.com/product-detail/en/samsung-electro-mechanics/CL05A105KP5NNNC/1276-1076-1-ND/3889162; Device Package: 0402 (1005 Metric); LastUpdated: 2.09.2020 01:02:21; Lifecycle Status: Active; Minimum Order: 1; Mounting Type: Surface Mount, MLCC; Operating Temperature: -55°C ~ 85°C; Package / Case: 0402 (1005 Metric); Packaging: TapeAndReel; PartId: 3103; Part Status: Active; Price: 0.01; Series: CL; Size / Dimension: 0.039" L x 0.020" W (1.00mm x 0.50mm); Supplier 1: DigiKey; Supplier Part Number 1: 1276-1076-1-ND; Temperature Coefficient: X5R; Thickness (Max): 0.022" (0.55mm); Voltage - Rated: 10V
IC5 = QPL9547: 0.1 -6 GHz Ultra Low-Noise LNA; Part Number: QPL9547; Supplier 1: Mouser; Supplier Part Number 1: 772-QPL9547SR
J9 J10 = CON-SMA-EDGE-S: CONN SMA JACK STR EDGE MNT; Part Number: CON-SMA-EDGE-S; Supplier 1: Digi-Key; Supplier 2: Mouser; Supplier Part Number 1: CON-SMA-EDGE-S-ND; Supplier Part Number 2: 223-CON-SMA-EDGE-S
L5 = 0402CS-18NXJLW: Fixed Inductors 1005 18nH Unshld 5% 420mA 230mOhms AECQ2; Value: 18nH; Supplier 1: Mouser; Supplier Part Number 1: 994-0402CS-18NXJLW
R6 = RC0402FR-073K32L: RES SMD 3.32K OHM 1% 1/16W 0402; Manufacturer: Yageo; Power (Watts): 0.063W, 1/16W; Temperature Coefficient: ±100ppm/°C; Part Number: RC0402FR-073K32L; Value: 3.32 kOhms; ComponentLink1Description: Datasheet; ComponentLink1URL: https://www.yageo.com/upload/media/product/productsearch/datasheet/rchip/PYu-RC_Group_51_RoHS_L_10.pdf; ComponentLink2Description: DigiKey Link; ComponentLink2URL: http://digikey.com/product-detail/en/yageo/RC0402FR-073K32L/311-3.32KLRCT-ND/2827944; Composition: Thick Film; Device Package: 0402 (1005 Metric); Features: Moisture Resistant; Height - Seated (Max): 0.016" (0.40mm); LastUpdated: 2.09.2020 01:07:35; Lifecycle Status: Active; Minimum Order: 1; Number of Terminations: 2; Operating Temperature: -55°C ~ 155°C; Package / Case: 0402 (1005 Metric); Packaging: CutTape; PartId: 17991; Part Status: Active; Price: 0.10; Resistance: 3.32 kOhms; Series: RC; Size / Dimension: 0.039" L x 0.020" W (1.00mm x 0.50mm); Supplier 1: DigiKey; Supplier Part Number 1: 311-3.32KLRCT-ND; Supplier Device Package: 0402; Tolerance: ±1%
R7 = RC0402JR-070RP: as R1 on sheet QPA9127; Part Number: RC0402JR-070RP; ComponentLink1Description: Datasheet; ComponentLink1URL: http://www.yageo.com/NewPortal/yageodocoutput?fileName=/pdf/R-Chip/PYu-RC_51_RoHS_P_0.pdf; ComponentLink2Description: DigiKey Link; ComponentLink2URL: http://digikey.com/product-detail/en/yageo/RC0402JR-070RP/YAG1279CT-ND/4935394; Composition: Thick Film; Device Package: 0402 (1005 Metric); Features: Moisture Resistant; Height - Seated (Max): 0.016" (0.40mm); LastUpdated: 2.09.2020 01:07:33; Lifecycle Status: Active; Minimum Order: 1; Number of Terminations: 2; Operating Temperature: -55°C ~ 155°C; Package / Case: 0402 (1005 Metric); Packaging: CutTape; PartId: 18920; Part Status: Active; Price: 0.10; Series: RC-P Lead Free; Size / Dimension: 0.039" L x 0.020" W (1.00mm x 0.50mm); Supplier 1: DigiKey; Supplier Part Number 1: YAG1279CT-ND; Supplier Device Package: 0402; Tolerance: Jumper
R8 = ERJ-2GEJ104X: RES SMD 100K OHM 5% 1/10W 0402; Manufacturer: Panasonic Electronic Components; Power (Watts): 0.1W, 1/10W; Temperature Coefficient: ±200ppm/°C; Part Number: ERJ-2GEJ104X; Value: 100 kOhms; ComponentLink1Description: Datasheet; ComponentLink1URL: https://b2b-api.panasonic.eu/file_stream/pids/fileversion/1242; ComponentLink2Description: DigiKey Link; ComponentLink2URL: http://digikey.com/product-detail/en/panasonic-electronic-components/ERJ-2GEJ104X/P100KJCT-ND/146730; Composition: Thick Film; Device Package: 0402 (1005 Metric); Features: Automotive AEC-Q200; Height - Seated (Max): 0.016" (0.40mm); LastUpdated: 2.09.2020 01:07:36; Lifecycle Status: Active; Minimum Order: 1; Number of Terminations: 2; Operating Temperature: -55°C ~ 155°C; Package / Case: 0402 (1005 Metric); Packaging: CutTape; PartId: 17613; Part Status: Active; Price: 0.10; Ratings: AEC-Q200; Resistance: 100 kOhms; Series: ERJ; Size / Dimension: 0.039" L x 0.020" W (1.00mm x 0.50mm); Supplier 1: DigiKey; Supplier Part Number 1: P100KJCT-ND; Supplier Device Package: 0402; Tolerance: ±5%
TP12-TP14 = Test Point-THM: THRU HOLE MOUNT TEST POINTS; Supplier 1: Digi-Key; Supplier 2: Mouser; Supplier Part Number 1: 36-5012-ND; Supplier Part Number 2: 534-5012